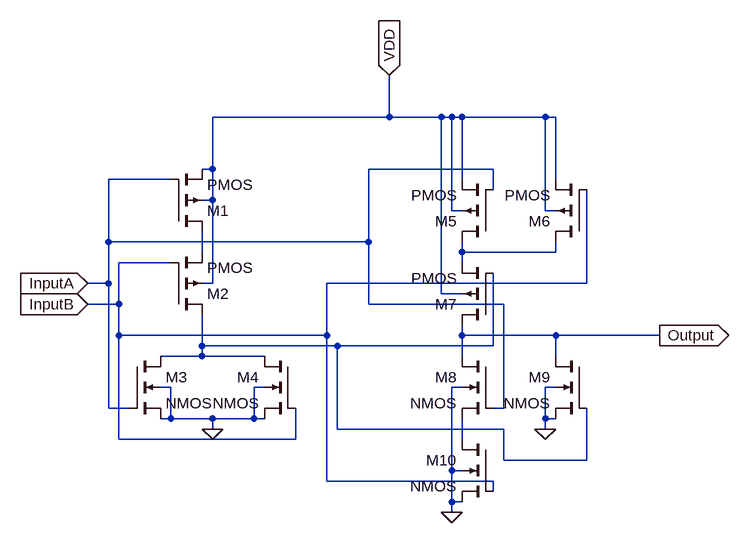
[diagram p0: schematic XOR.asc]
XOR.asc, the LTspice schematic file:
Version 4.1
SHEET 1 1084 680
WIRE 528 -48 528 -112
WIRE 528 -48 256 -48
WIRE 608 -48 528 -48
WIRE 624 -48 608 -48
WIRE 640 -48 624 -48
WIRE 768 -48 640 -48
WIRE 784 -48 768 -48
WIRE 256 32 256 -48
WIRE 256 32 240 32
WIRE 688 32 496 32
WIRE 192 48 96 48
WIRE 640 48 640 -48
WIRE 784 48 784 -48
WIRE 688 64 688 32
WIRE 256 80 256 32
WIRE 256 80 240 80
WIRE 624 96 624 -48
WIRE 640 96 624 96
WIRE 768 96 768 -48
WIRE 784 96 768 96
WIRE 96 144 96 48
WIRE 496 144 496 32
WIRE 496 144 96 144
WIRE 240 160 240 128
WIRE 640 160 640 144
WIRE 784 160 784 144
WIRE 784 160 640 160
WIRE 192 176 112 176
WIRE 640 176 640 160
WIRE 96 208 96 144
WIRE 96 208 64 208
WIRE 256 208 256 80
WIRE 256 208 240 208
WIRE 832 208 832 64
WIRE 832 208 432 208
WIRE 608 224 608 -48
WIRE 640 224 608 224
WIRE 112 240 112 176
WIRE 112 240 64 240
WIRE 496 240 496 144
WIRE 704 240 496 240
WIRE 112 288 112 240
WIRE 432 288 432 208
WIRE 432 288 112 288
WIRE 640 288 640 272
WIRE 784 288 640 288
WIRE 944 288 784 288
WIRE 240 304 240 256
WIRE 448 304 240 304
WIRE 688 304 688 192
WIRE 688 304 448 304
WIRE 240 320 240 304
WIRE 240 320 176 320
WIRE 336 320 240 320
WIRE 640 320 640 288
WIRE 784 320 784 288
WIRE 192 368 176 368
WIRE 336 368 320 368
WIRE 640 368 624 368
WIRE 784 368 768 368
WIRE 96 400 96 208
WIRE 128 400 96 400
WIRE 704 400 704 240
WIRE 704 400 688 400
WIRE 192 416 192 368
WIRE 192 416 176 416
WIRE 256 416 192 416
WIRE 320 416 320 368
WIRE 320 416 256 416
WIRE 336 416 320 416
WIRE 768 416 768 368
WIRE 784 416 768 416
WIRE 256 432 256 416
WIRE 448 432 448 304
WIRE 704 432 448 432
WIRE 768 432 768 416
WIRE 112 448 112 288
WIRE 384 448 384 400
WIRE 384 448 112 448
WIRE 640 448 640 416
WIRE 704 480 704 432
WIRE 832 480 832 400
WIRE 832 480 704 480
WIRE 624 496 624 368
WIRE 640 496 624 496
WIRE 432 512 432 288
WIRE 688 512 432 512
WIRE 688 528 688 512
WIRE 624 544 624 496
WIRE 640 544 624 544
WIRE 624 560 624 544
FLAG 256 432 0
FLAG 624 560 0
FLAG 768 432 0
FLAG 64 208 InputA
IOPIN 64 208 In
FLAG 64 240 InputB
IOPIN 64 240 In
FLAG 944 288 Output
IOPIN 944 288 Out
FLAG 528 -112 VDD
IOPIN 528 -112 In
SYMBOL pmos4 192 128 M180
SYMATTR InstName M1
SYMATTR Value2 l=1 w=4
SYMBOL pmos4 192 256 M180
SYMATTR InstName M2
SYMATTR Value2 l=1 w=4
SYMBOL nmos4 128 320 R0
SYMATTR InstName M3
SYMATTR Value2 l=1 w=2
SYMBOL nmos4 384 320 M0
SYMATTR InstName M4
SYMATTR Value2 l=1 w=2
SYMBOL pmos4 688 144 R180
SYMATTR InstName M5
SYMATTR Value2 l=1 w=4
SYMBOL pmos4 832 144 R180
SYMATTR InstName M6
SYMATTR Value2 l=1 w=4
SYMBOL pmos4 688 272 R180
SYMATTR InstName M7
SYMATTR Value2 l=1 w=4
SYMBOL nmos4 688 320 M0
SYMATTR InstName M8
SYMATTR Value2 l=1 w=2
SYMBOL nmos4 832 320 M0
SYMATTR InstName M9
SYMATTR Value2 l=1 w=2
SYMBOL nmos4 688 448 M0
SYMATTR InstName M10
SYMATTR Value2 l=1 w=2

The netlist it stands for:
* XOR.asc
M1 N001 InputA VDD VDD PMOS l=1 w=4
M2 N003 InputB N001 VDD PMOS l=1 w=4
M3 N003 InputA 0 0 NMOS l=1 w=2
M4 N003 InputB 0 0 NMOS l=1 w=2
M5 N002 InputA VDD VDD PMOS l=1 w=4
M6 N002 InputB VDD VDD PMOS l=1 w=4
M7 Output N003 N002 VDD PMOS l=1 w=4
M8 Output InputA N004 0 NMOS l=1 w=2
M9 Output N003 0 0 NMOS l=1 w=2
M10 N004 InputB 0 0 NMOS l=1 w=2
.model NMOS NMOS
.model PMOS PMOS
.lib standard.mos
.backanno
.end